# Altium schematic sheet Instrumentation Amplifier (Emergency Version).SchDoc
size A; SheetNumber: 1; SheetTotal: 1
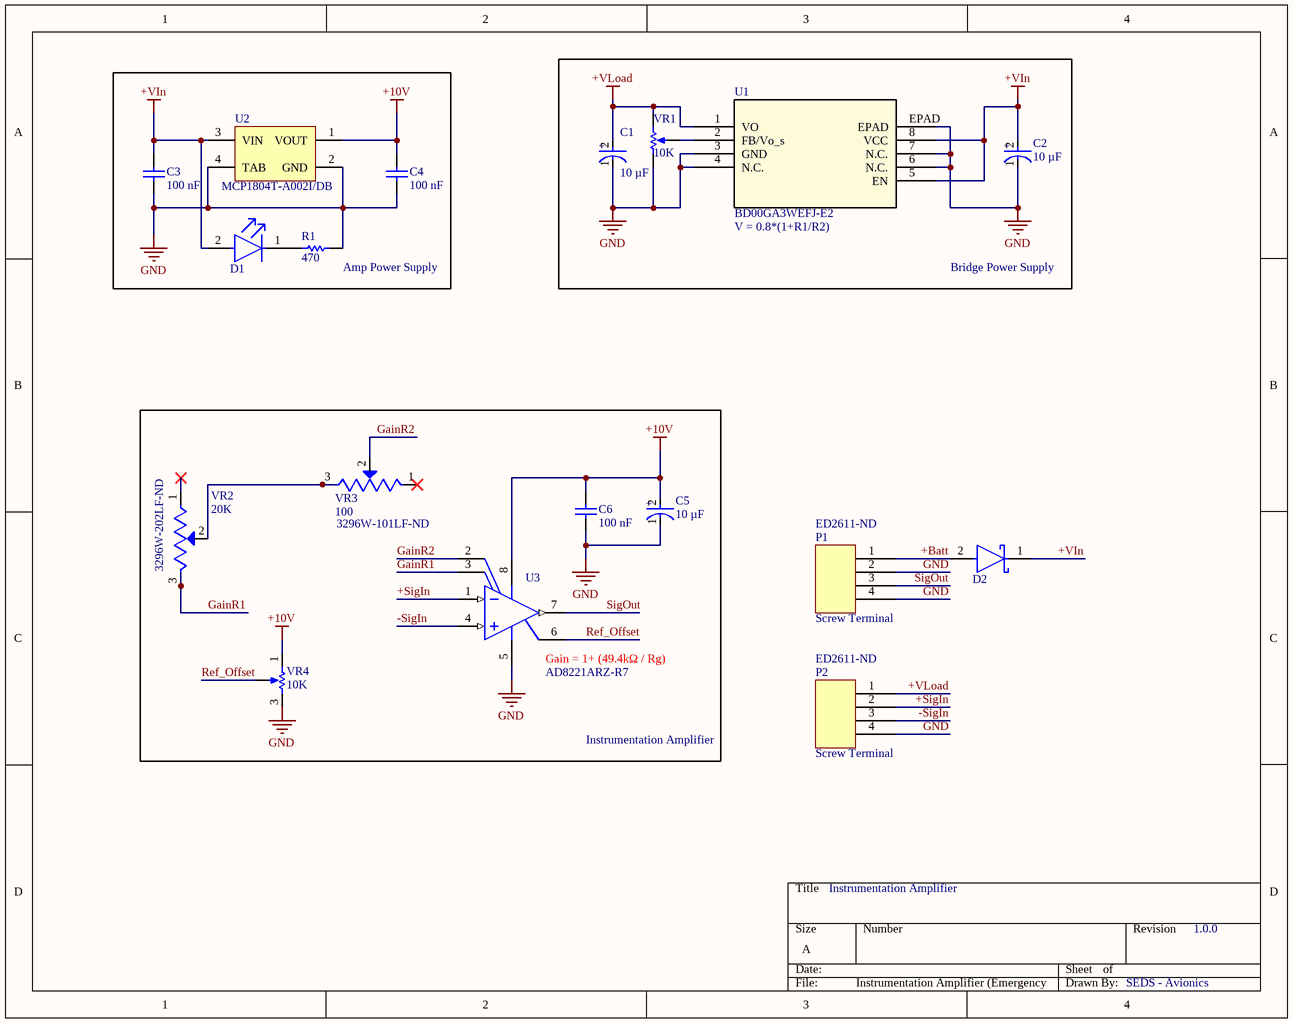
[diagram p0: Instrumentation Amplifier (Emergency Version).SchDoc]

## Parts
C1  10 µF  [FP-TAP106K016SCS-MFG]
C2  10 µF  [FP-TAP106K016SCS-MFG]
C3  100 nF  [CAPC1608X95X40ML15T15]
C4  100 nF  [CAPC1608X95X40ML15T15]
C5  10 µF  [FP-TAP106K016SCS-MFG]
C6  100 nF  [CAPC1608X95X40ML15T15]
D1  LTST-C191KGKT  [FP-LTST-C191KGKT-MFG]  (value not drawn)
D2  VS-10BQ015-M3/5BT  [FP-95401-MFG]  (value not drawn)
P1  Screw Terminal  Supplier Part Number 1: ED2611-ND  [Screw Terminal]
P2  Screw Terminal  Supplier Part Number 1: ED2611-ND  [Screw Terminal]
R1  470  [RESC1608X55X30NL15T15]
U1  BD00GA3WEFJ-E2  [HTSOP-J8_ROM]
U2  MCP1804T-A002I/DB  [SOT-223-DB3_N]
U3  AD8221ARZ-R7  [ADI-R-8_M]
VR1  10K  [BOUR-3296W]
VR2  20K  Supplier Part Number 1: 3296W-202LF-ND  [TRIM_3296W-1-202LF]
VR3  100  Supplier Part Number 1: 3296W-101LF-ND  [TRIM_3296W-1-101LF]
VR4  10K  [BOUR-3296W]

## Blocks framed on the sheet
Amp Power Supply: C3 C4 D1 R1 U2

## Nets
+10V: C4.2 C5.2(A) C6.2 U2.1(VOUT) U3.8(VS+) VR4.1(CCW)
+VIn: C2.2(A) C3.2 D1.2(A) D2.1(C) U1.5(EN) U1.8(VCC) U2.3(VIN)
+VLoad: C1.2(A) P2.1(Pin1) U1.1(VO) VR1.3(CW)
GND: C1.1(C) C2.1(C) C3.1 C4.1 C5.1(C) C6.1 P1.2(Pin2) P1.4(Pin4) P2.4(Pin4) R1.2 U1.3(GND) U1.4(N.C.) U1.6(N.C.) U1.7(N.C.) U1.EPAD U2.2(GND) U2.4(TAB) U3.5(VS-) VR1.1(CCW) VR4.3(CW)
+Batt: D2.2(A) P1.1(Pin1)
+SigIn: P2.2(Pin2) U3.1(IN-)
-SigIn: P2.3(Pin3) U3.4(IN+)
GainR1: U3.3(RG) VR2.3(CW)
GainR2: U3.2(RG) VR3.2(WIPER)
Ref_Offset: U3.6(REF) VR4.2(S)
SigOut: P1.3(Pin3) U3.7(VOUT)
NetD1_1: D1.1(C) R1.1
NetU1_2: U1.2(FB/Vo_s) VR1.2(S)
NetVR2_2: VR2.2(WIPER) VR3.3(CW)

Not connected (* = marked no-connect by the designer): VR2 1(CCW)*; VR3 1(CCW)*

## Notes on the sheet
- (near U1) V = 0.8*(1+R1/R2)
- Bridge Power Supply
- (near U3) Gain = 1+ (49.4kΩ / Rg)
- Instrumentation Amplifier
- 1.0.0
- SEDS - Avionics
- (in symbol CMP-04424-000616-1) +

## Library data of the parts
C1 C2 C5 = CMP-04424-000616-1: CAP TANT 10UF 10% 16V RADIAL; Dissipation Factor: 8%; Dielectric Material: Tantalum; Leakage Current: 1.2uA; Polarity: Polar; Life (Hours): 1000Hour; ESR (Equivalent Series Resistance): 3.2R; Lead Diameter: 0.5mm; Packaging: Bulk; Min Operating Temperature: -55°C; RoHS Compliant: Yes; Construction: RADIAL; Length: 9mm; Number of Pins: 2; Height - Seated (Max): 0.354inch; Termination: Radial; Tolerance: 10%; Case/Package: Dipped; Voltage Rating (DC): 16V; Voltage Rating: 16V; Lead Pitch: 2.5mm; Size: 9mm; Voltage: 16V; Lead Free: Lead Free; Mount: Through Hole; Height: 9mm; Max Operating Temperature: 125°C; Features: General Purpose; Diameter: 5mm; Radiation Hardening: No; Package Quantity: 1000; Series: TAP; Capacitance: 10uF
C3 C4 C6 = CMP-2006-01550-1: Manufacturer: Vitramon; Part Number: VJ0603Y104KXQCW1BC
D1 = CMP-2000-05198-2: LED GREEN CLEAR SMD; Max Power Dissipation: 75mW; Forward Current: 30mA; Reverse Voltage: 5V; Lens Color: Colorless; Forward Voltage: 2V; Dominant Wavelength: 571nm; Number of LEDs: 1; Viewing Angle: 130°; Lens Style: Rectangular; Test Current: 20mA; Luminous Intensity: 35mcd; Wavelength: 574nm; Width: 0.8mm; Case Code (Imperial): 0603; Number of Pins: 2; Lead Free: Lead Free; Packaging: Tape and Reel; Package Quantity: 1; Min Operating Temperature: -55°C; Case/Package: 0603; Length: 1.6mm; Power Dissipation: 75mW; Depth: 0.8mm; Radiation Hardening: No; Mount: Surface Mount; Max Operating Temperature: 85°C; Color: Green; Power Rating: 75mW; Height: 0.55mm; Illumination Color: Green; Case Code (Metric): 1608; Lens Transparency: Clear; Number of Elements: 1
D2 = CMP-02539-000017-1: DIODE SCHOTTKY 15V 1A DO214AA; Manufacturer: Vishay; Standoff Height: 0mm; Value: 390pF; Max Surge Forward Current: 40A; Peak Reverse Current: 0.5mA; Max Junction Temp: +125°C; Max Repetitive Reverse Voltage: 15V; Mouser Description: VS-10BQ015 Series 15 V 1 A SMT Schottky Rectifier - SMB (DO-214AA); Device Class L1: Discrete Semiconductors; Height: 2.44mm; ComponentLink2Description: Datasheet; ComponentLink2URL: http://www.vishay.com/docs/93349/vs-10bq015m.pdf; Footprint Url: http://www.vishay.com/docs/95401/smb.pdf; Reverse Voltage: 15V; Device Class L2: Diodes; Package: 95401; Temperature Range High: +125°C; Manufacturer Part Number: VS-10BQ015-M3/5BT; Category: Diode; Device Class L3: Schottky Diodes; Temperature Range Low: -55°C; Capacitance: 390pF; RoHS: TRUE; Octopart: https://octopart.com/vs-10bq015-m3%2F5bt-vishay-39003459; Forward Current: 1A; Digikey Description: DIODE SCHOTTKY 15V 1A DO214AA; Temperature: -55°C to +125°C; Lead Free: Yes; Automotive: No
P1 P2 = Screw Terminal: Conn Terminal Block 4 POS 5.08mm Solder ST Thru-Hole 15A; Manufacturer: On-Shore Technology; Manufacturer Part Number: OSTTC042162; Plating: Steel; Number of Levels: 1; Number of Positions Per Level: 4; Voltage: 300V; Wire Gauge (Max): 22AWG; Wire Gauge (Min): 14AWG; Pitch: 0.2inch; Supplier 1: Digi-Key; RoHS: Yes; Category: Terminal Blocks; Stock 1: 18949; Pricing 1: 1=1.19000, 10=0.74000, 25=0.63360, 50=0.56960, 100=0.55770, 250=0.47460, 500=0.45088, 1000=0.40341, 5000=0.31640 (USD); Mount: Through Hole; Number of Pins: 4; Color: Blue; Contact Plating: Tin; Housing Color: Blue; Contact Material: Brass; Housing Material: Thermoplastic; Min Operating Temperature: -30°C; Max Operating Temperature: 105°C; Packaging: Bulk; Current: 15A; Termination: Screw; Number of Positions: 4; Number of Rows: 1; Series: OSTTC; Length: 20.3mm; Width: 7.6mm; Height: 10mm; Flammability Rating: UL94 V-0; ComponentLink1URL: https://datasheet.ciiva.com/823/osttcxx2162-823942.pdf?src-supplier=Digi-Key; ComponentLink1Description: https://datasheet.ciiva.com/823/osttcxx2162-823942.pdf?src-supplier=Digi-Key
R1 = CMP-2000-00795-1: ERJ-3GEYJ471V; Manufacturer: Panasonic; Part Number: ERJ-3GEYJ471V
U1 = BD00GA3WEFJ-E2: IC REG LDO ADJ 0.3A 8HTSOP-J; Mfr_Name: ROHM Semiconductor; Manufacturer: Rohm; Dropout Voltage: 600mV; Output Current: 300mA; Number of Outputs: 1; Min Input Voltage: 4.5V; Max Input Voltage: 8V; Output Voltage: 13V; Max Power Dissipation: 2.11W; Min Output Voltage: 1.5V; Output Type: Adjustable; Copyright: Copyright (C) 2022 Ultra Librarian. All rights reserved.; Manufacturer_Part_Number: BD00GA3WEFJ-E2; Digi-Key_Part_Number_1: BD00GA3WEFJ-E2TR-ND; Digi-Key_Part_Number_2: BD00GA3WEFJ-E2CT-ND; Digi-Key_Part_Number_3: BD00GA3WEFJ-E2DKR-ND; RefDes: RefDes; Type: DEV; Supplier 1: Digi-Key; Supplier Part Number 1: BD00GA3WEFJ-E2CT-ND; Manufacturer Part Number: BD00GA3WEFJ-E2; RoHS: Yes; Category: Voltage Regulators - Linear; Stock 1: 992; Pricing 1: 1=0.87000, 10=0.77000, 25=0.72280, 100=0.59000, 250=0.54800, 500=0.46640, 1000=0.37312 (USD); Mount: Surface Mount; Number of Pins: 8; Contact Plating: Copper,Tin; Min Operating Temperature: -25°C; Max Operating Temperature: 85°C; Package Quantity: 1; Packaging: Tape and Reel; Max Output Current: 300mA; Number of Regulators: 1; Max Output Voltage: 13V; Series: -; REACH SVHC: Unknown; Lead Free: Lead Free; RoHS Compliant: Yes; ComponentLink1URL: https://datasheet.ciiva.com/13009/bd00ga3wefj-e-209065-13009268.pdf?src-supplier=Mouser; ComponentLink1Description: https://datasheet.ciiva.com/13009/bd00ga3wefj-e-209065-13009268.pdf?src-supplier=Mouser; ComponentLink2URL: https://datasheet.ciiva.com/2040/bd00ga3wefj-e-2040001.pdf?src-supplier=Digi-Key; ComponentLink2Description: https://datasheet.ciiva.com/2040/bd00ga3wefj-e-2040001.pdf?src-supplier=Digi-Key
U2 = CMP-0136-00501-1: 150 mA, 28V LDO Regulator With Shutdown, 3-Pin SOT-223, Industrial Temperature, Tape and Reel; PackageDescription: 3-Lead Plastic Small Outline Transistor (DB) [SOT-223]; PackageReference: SOT-223-DB3; DatasheetVersion: revB, Nov-2009; PackageVersion: revBB, Aug-2009
U3 = CMP-0934-00044-1: Precision Instrumentation Amplifier, 2 V/us, -40 to 125 degC, 8-Pin SOIC (R-8), RoHS, Tape and Reel; Manufacturer: Analog Devices; Slew Rate@G: 1=2 V/us Typ.; VIO: 60 uV Max.; Quiescent Current: 0.9 mA Typ.; -3dB Bandwidth@G: 1=825 kHz; Packing: Tape and Reel; ComponentLink1URL: http://www.analog.com/en/index.html; ComponentLink2URL: http://www.analog.com/static/imported-files/data_sheets/AD8221.pdf; Mounting Technology: Surface Mount; PackageVersion: Jun-06; ComponentLink2Description: Datasheet; Temperature Range: -40 to 125 degC; PartNumber: AD8221ARZ-R7; ComponentLink1Description: Manufacturer URL; DatasheetVersion: Rev. C; RoHS: TRUE; ComponentLink3URL: http://www.analog.com/static/imported-files/packages/PKG_PDF/SOIC_Narrow%20(R)/R_8.pdf; ComponentLink3Description: Package Specification; PackageDescription: 8-Pin Standard Small Outline Package, Body 4.9 x 3.9 mm, Pitch 1.27 mm
VR1 VR4 = CMP-1747-00001-1: 3296W-1-103LF / Square Trimpot(R) Trimming Potentiometer, 10 KOhm, +/- 10%, 0.5 W, -55 to 125 degC, 3-Pin THD, RoHS, Tube; Voltage Rating: 75 V; Resistance: 120 Ohm; Tolerance: 1%; Power Rating: 100 mW; Case\Package: 0603; Type (Resistor): Thick Film; PackageDescription: 3-Pin Through Hole Device, Body 9.53 x 4.83 mm, Pitch 2.54 mm; RoHSCompliant: true; Package Quantity: 5000; Case Code (Metric): 1608; PackageReference: 3296W; ComponentLink2Description: Datasheet; REACH SVHC: Unknown; Case Code (Imperial): 0603; ComponentLink1URL: http://www.bourns.com/; Width: 0.85 mm; Radiation Hardening: No; Min Operating Temperature: -55 degC; Mount: Surface Mount; ComponentLink1Description: Manufacturer URL; Max Operating Temperature: 155 degC; Weight: 7.1E-05 oz; Pins: 2; DatasheetVersion: May-16; Packaging: Tape and Reel; Height: 0.45 mm; Length: 1.55 mm; ComponentLink2URL: http://www.bourns.com/docs/Product-Datasheets/3296.pdf
VR2 = 3296W-1-202LF: Trimmer Potentiometer 2k Ohm 10% 1/2 Watt 25 Turn 2.19mm Pin Through Hole; MF: Bourns; Resistance: 2kR; Power Rating: 500mW; Number of Turns: 25; Temperature Coefficient: 100ppm/°C; Availability: In Stock; Value: *; SnapEDA_Link: https://www.snapeda.com/parts/3296W-1-202LF/Bourns/view-part/?ref=snap; Package: SOT-23-5 Bourns; Purchase-URL: https://pricing.snapeda.com/search/part/3296W-1-202LF/?ref=eda; Price: None; Check_prices: https://www.snapeda.com/parts/3296W-1-202LF/Bourns/view-part/?ref=eda; MP: 3296W-1-202LF; Supplier 1: Digi-Key; Manufacturer: Bourns; Manufacturer Part Number: 3296W-1-202LF; RoHS: Yes; Category: Variable Resistors and Potentiometers; Stock 1: 7173; Pricing 1: 1=2.43000, 10=2.13800, 25=1.91680, 50=1.84320, 100=1.76950, 250=1.69580, 500=1.40088, 1000=1.32714, 5000=1.10595 (USD); Mount: Panel,Through Hole,PCB; Weight: 0.03oz; Color: Blue; Contact Plating: Tin,Matte; Min Operating Temperature: -55°C; Max Operating Temperature: 125°C; Tolerance: 10%; Packaging: Rail/Tube; Termination: Pin; Resistor Type: Cermet; Technology: CERMET; Package Quantity: 50; Taper: Linear; Max Power Dissipation: 500mW; Series: 3296; Resistance Tolerance: 10%; Length: 9.53mm; Width: 9.53mm; Height: 0.395inch; Depth: 4.83mm; Radiation Hardening: No; Military Standard: Not; REACH SVHC: No SVHC; Lead Free: Lead Free; RoHS Compliant: Yes; ComponentLink1URL: https://datasheet.ciiva.com/11830/0900766b8069ccf4-11830813.pdf?src-supplier=RSComponents; ComponentLink1Description: https://datasheet.ciiva.com/11830/0900766b8069ccf4-11830813.pdf?src-supplier=RSComponents; ComponentLink2URL: https://datasheet.ciiva.com/27049/769426-27049909.pdf?src-supplier=Jameco; ComponentLink2Description: https://datasheet.ciiva.com/27049/769426-27049909.pdf?src-supplier=Jameco; ComponentLink3URL: https://datasheet.ciiva.com/29122/447280-da-01-en-trimmer-tht3296w-1-202lf-2k-0-5w-29122371.pdf?src-supplier=Conrad; ComponentLink3Description: https://datasheet.ciiva.com/29122/447280-da-01-en-trimmer-tht3296w-1-202lf-2k-0-5w-29122371.pdf?src-supplier=Conrad; ComponentLink4URL: https://datasheet.ciiva.com/14173/ew3296-dat-e-14173020.pdf?src-supplier=Distrelec; ComponentLink4Description: https://datasheet.ciiva.com/14173/ew3296-dat-e-14173020.pdf?src-supplier=Distrelec; ComponentLink5URL: https://datasheet.ciiva.com/2156/3296-2156903.pdf?src-supplier=Digi-Key; ComponentLink5Description: https://datasheet.ciiva.com/2156/3296-2156903.pdf?src-supplier=Digi-Key; ComponentLink6URL: https://datasheet.ciiva.com/30201/3296-30201433.pdf?src-supplier=Onlinecomponents.com; ComponentLink6Description: https://datasheet.ciiva.com/30201/3296-30201433.pdf?src-supplier=Onlinecomponents.com; ComponentLink7URL: https://datasheet.ciiva.com/16714/70153578-16714838.pdf?src-supplier=Allied+Electronics; ComponentLink7Description: https://datasheet.ciiva.com/16714/70153578-16714838.pdf?src-supplier=Allied+Electronics; ComponentLink8URL: https://datasheet.ciiva.com/1131/1815117-1131338.pdf?src-supplier=Element14; ComponentLink8Description: https://datasheet.ciiva.com/1131/1815117-1131338.pdf?src-supplier=Element14
VR3 = 3296W-1-101LF: Res Cermet Trimmer 100 Ohm 10% 1/2W 25(Elec)Turn 2.19mm (9.53 X 4.83 X 11.55mm) Pin Thru-Hole Tube; MF: Bourns; Resistance: 100R; Power Rating: 500mW; Number of Turns: 25; Temperature Coefficient: 100ppm/°C; Purchase-URL: https://pricing.snapeda.com/search/part/3296W-1-101LF/?ref=eda; Package: SOT-23-5 Bourns; SnapEDA_Link: https://www.snapeda.com/parts/3296W-1-101LF/Bourns/view-part/?ref=snap; MP: 3296W-1-101LF; Value: *; Availability: In Stock; Price: None; Check_prices: https://www.snapeda.com/parts/3296W-1-101LF/Bourns/view-part/?ref=eda; Supplier 1: Digi-Key; Manufacturer: Bourns; Manufacturer Part Number: 3296W-1-101LF; RoHS: Yes; Category: Variable Resistors and Potentiometers; Stock 1: 7547; Pricing 1: 1=2.43000, 10=2.13800, 25=1.91680, 50=1.84320, 100=1.76950, 250=1.69580, 500=1.40088, 1000=1.32714, 5000=1.10595 (USD); Mount: Through Hole,Panel,PCB; Weight: 0.03oz; Color: Blue; Min Operating Temperature: -55°C; Max Operating Temperature: 125°C; Tolerance: 10%; Packaging: Rail/Tube; Resistor Type: Cermet; Termination: Pin; Technology: CERMET; Package Quantity: 50; Taper: Linear; Max Power Dissipation: 500mW; Series: 3296; Resistance Tolerance: 10%; Length: 9.53mm; Width: 9.53mm; Height: 0.395inch; Depth: 4.83mm; Radiation Hardening: No; Military Standard: Not; REACH SVHC: No SVHC; Lead Free: Lead Free; RoHS Compliant: Yes; ComponentLink1URL: https://datasheet.ciiva.com/27051/1156761-27051539.pdf?src-supplier=Jameco; ComponentLink1Description: https://datasheet.ciiva.com/27051/1156761-27051539.pdf?src-supplier=Jameco; ComponentLink2URL: https://datasheet.ciiva.com/11831/0900766b8069ccf4-11831769.pdf?src-supplier=RSComponents; ComponentLink2Description: https://datasheet.ciiva.com/11831/0900766b8069ccf4-11831769.pdf?src-supplier=RSComponents; ComponentLink3URL: https://datasheet.ciiva.com/19466/853530-19466630.pdf?src-supplier=Jameco; ComponentLink3Description: https://datasheet.ciiva.com/19466/853530-19466630.pdf?src-supplier=Jameco; ComponentLink4URL: https://datasheet.ciiva.com/29122/447275-da-01-en-trimmer-tht3296w-1-101lf-100r-0-5w-29122365.pdf?src-supplier=Conrad; ComponentLink4Description: https://datasheet.ciiva.com/29122/447275-da-01-en-trimmer-tht3296w-1-101lf-100r-0-5w-29122365.pdf?src-supplier=Conrad; ComponentLink5URL: https://datasheet.ciiva.com/14173/ew3296-dat-e-14173016.pdf?src-supplier=Distrelec; ComponentLink5Description: https://datasheet.ciiva.com/14173/ew3296-dat-e-14173016.pdf?src-supplier=Distrelec; ComponentLink6URL: https://datasheet.ciiva.com/3266/3296-3266184.pdf?src-supplier=Avnet; ComponentLink6Description: https://datasheet.ciiva.com/3266/3296-3266184.pdf?src-supplier=Avnet; ComponentLink7URL: https://datasheet.ciiva.com/15156/getdatasheetpartid-42868-15156283.pdf?src-supplier=Verical; ComponentLink7Description: https://datasheet.ciiva.com/15156/getdatasheetpartid-42868-15156283.pdf?src-supplier=Verical; ComponentLink8URL: https://datasheet.ciiva.com/2158/3296-2158306.pdf?src-supplier=Digi-Key; ComponentLink8Description: https://datasheet.ciiva.com/2158/3296-2158306.pdf?src-supplier=Digi-Key; ComponentLink9URL: https://datasheet.ciiva.com/30209/3296-30209439.pdf?src-supplier=Onlinecomponents.com; ComponentLink9Description: https://datasheet.ciiva.com/30209/3296-30209439.pdf?src-supplier=Onlinecomponents.com; ComponentLink10URL: https://datasheet.ciiva.com/1131/1815117-1131271.pdf?src-supplier=Element14; ComponentLink10Description: https://datasheet.ciiva.com/1131/1815117-1131271.pdf?src-supplier=Element14